# Altium schematic sheet Sheet1.SchDoc
size A4
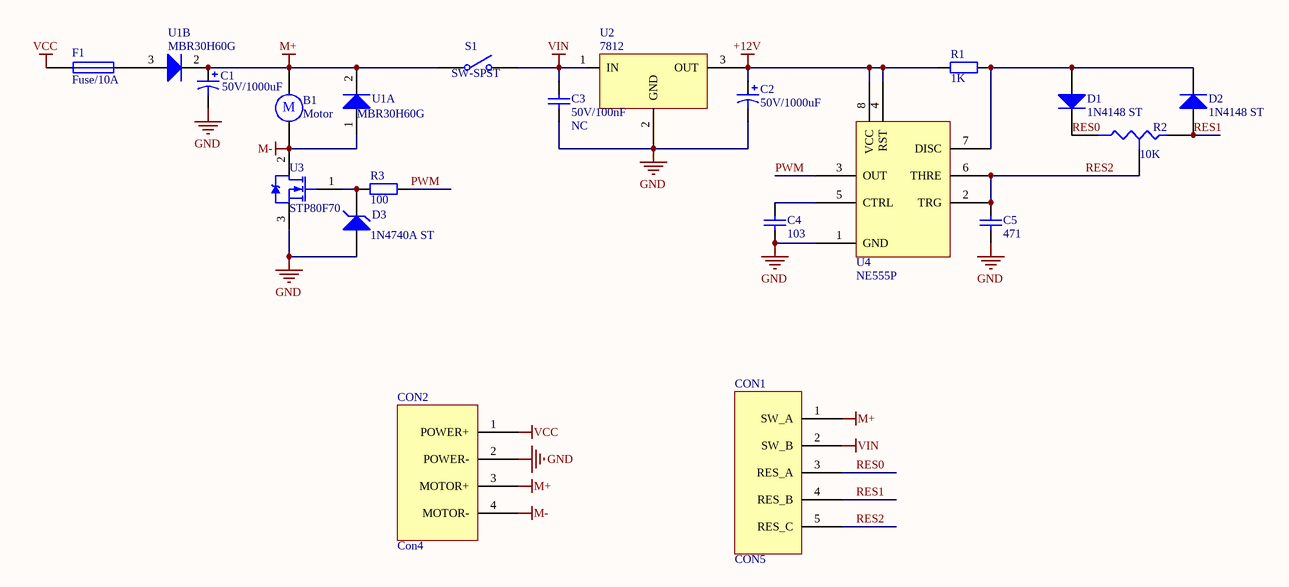
[diagram p0: Sheet1.SchDoc]

## Parts
B1  Motor  [RB5-10.5]
C1  50V/1000uF  [C0805]
C2  50V/1000uF  [C0805]
C3  50V/100nF  value NC  [RAD-0.3]
C4  103  [RAD-0.3]
C5  471  [RAD-0.3]
CON1  CON5
CON2  Con4
D1  1N4148 ST  [SMC]
D2  1N4148 ST  [SMC]
D3  1N4740A ST  [DIODE-0.7]
F1  Fuse/10A  [PIN-W2/E2.8]
R1  1K  [AXIAL-0.4]
R2  10K  [VR3]
R3  100  [AXIAL-0.4]
S1  SW-SPST  [SPST-2]
U1  MBR30H60G  (parts A,B of 2)
U2  7812
U3  STP80F70
U4  NE555P

## Nets
+12V: C2.1 R1.1 U2.3(OUT) U4.4(RST) U4.8(VCC)
GND: C1.2 C2.2 C3.1 C4.1 C5.1 CON2.2(POWER-) D3.1(A) U2.2(GND) U3.3(S) U4.1(GND)
M+: B1.1 C1.1 CON1.1(SW_A) CON2.3(MOTOR+) S1.1(COMMON) U1.2(K)
M-: B1.2 CON2.4(MOTOR-) U1.1(A) U3.2(D)
VCC: CON2.1(POWER+) F1.1
VIN: C3.2 CON1.2(SW_B) S1.2(NO) U2.1(IN)
PWM: R3.1 U4.3(OUT)
RES0: CON1.3(RES_A) D1.2(K) R2.2(B)
RES1: CON1.4(RES_B) D2.1(A) R2.1(A)
RES2: C5.2 CON1.5(RES_C) R2.3(TAP) U4.2(TRG) U4.6(THRE)
NetC4_2: C4.2 U4.5(CTRL)
NetD1_1: D1.1(A) D2.2(K) R1.2 U4.7(DISC)
NetD3_2: D3.2(K) R3.2 U3.1(G)
NetF1_2: F1.2 U1.3(A)

## Notes on the sheet
- (in symbol Motor) M

## Library data of the parts
B1 = Motor: Motor, General Kind; Published: 24-Mar-1999; LatestRevisionDate: 17-Jul-2002; LatestRevisionNote: Re-released for DXP Platform.; PackageReference: RB5-10.5; Publisher: Altium Limited; PackageDescription: Capacitor (Radial); 2 Leads
C1 C2 = Cap Pol3: Polarized Capacitor (Surface Mount); Value: 100pF; Published: 8-Jun-2000; LatestRevisionDate: 29-May-2009; LatestRevisionNote: IPC-7351 Footprint Added.; PackageReference: C0805; Publisher: Altium Limited; PackageDescription: Chip Capacitor
C3-C5 = Cap: Capacitor; Published: 8-Jun-2000; LatestRevisionDate: 17-Jul-2002; LatestRevisionNote: Re-released for DXP Platform.; PackageReference: RAD-0.3; Publisher: Altium Limited; PackageDescription: Radial Cap, Thru-Hole; 2 Leads; 0.3 in Pin Spacing
D1 D2 = Diode: Default Diode; Published: 8-Jun-2000; LatestRevisionDate: 17-Jul-2002; LatestRevisionNote: Re-released for DXP Platform.; PackageVersion: Sep-1996; PackageReference: SMC; Publisher: Altium Limited; PackageDescription: DO-214-AB/SMC; 2 C-Bend Leads; Body 7.9 x 5.9 mm, inc. leads (LxW); Code_JEDEC: DO-214-AB
D3 = D Zener: Zener Diode; Published: 8-Jun-2000; LatestRevisionDate: 17-Jul-2002; LatestRevisionNote: Re-released for DXP Platform.; PackageReference: DIODE-0.7; Publisher: Altium Limited; PackageDescription: Diode, Thru-Hole; 2 Leads; 0.7 in Pin Spacing
F1 = Fuse 1: Fuse; Published: 8-Jun-2000; LatestRevisionDate: 17-Jul-2002; LatestRevisionNote: Re-released for DXP Platform.; PackageReference: PIN-W2/E2.8; Publisher: Altium Limited; PackageDescription: Thru-Hole; 2 Leads
R1 = Res2: Resistor; Published: 8-Jun-2000; LatestRevisionDate: 17-Jul-2002; LatestRevisionNote: Re-released for DXP Platform.; PackageReference: AXIAL-0.4; Publisher: Altium Limited; PackageDescription: Axial Device, Thru-Hole; 2 Leads; 0.4 in Pin Spacing; Value: 1K
R2 = Res Tap: Tapped Resistor; Sim Note: Enter the Resistance value and the set point into parameter fields.; Set Position: 0.5; Published: 24-Mar-1999; LatestRevisionDate: 17-Jul-2002; LatestRevisionNote: Re-released for DXP Platform.; PackageReference: VR3; Publisher: Altium Limited; PackageDescription: Variable Resistor, Thru-Hole; 3 Leads; Value: 10K
R3 = Res2: Resistor; Value: 1K; Published: 8-Jun-2000; LatestRevisionDate: 17-Jul-2002; LatestRevisionNote: Re-released for DXP Platform.; PackageReference: AXIAL-0.4; Publisher: Altium Limited; PackageDescription: Axial Device, Thru-Hole; 2 Leads; 0.4 in Pin Spacing
S1 = SW-SPST: Single-Pole, Single-Throw Switch; Published: 24-Mar-1999; LatestRevisionDate: 17-Jul-2002; LatestRevisionNote: Re-released for DXP Platform.; PackageReference: SPST-2; Publisher: Altium Limited; PackageDescription: Switch; 2 Leads
U1 = MBR30H60G: 60V, 30A SCHOTTKY
U2 = 7812: POSITIVE VOLTAGE REGULATORS
U3 = STP80NF70: N-channel 68 V, 0.0082 Ω, 98 A, TO-220 MOSFET
U4 = NE555P: GENERAL PURPOSE SINGLE BIPOLAR TIMERS